# Altium schematic sheet MCU099_02_XDS110_Debug_Probe.SchDoc: XDS110-ET Debug Probe
size 431 x 279 mm; Date: Not shown in title block; ApprovedBy: Not shown in title block; CheckedBy: Not shown in title block; Author: Not shown in title block; CompanyName: Not shown in title block; DrawnBy: Johnson He; Engineer: Not shown in title block; Organization: Not shown in title block; Address1: Not shown in title block; Address2: Not shown in title block; Address3: Not shown in title block; Address4: Not shown in title block; DocumentNumber: 1; Revision: Use project parameter SCH_Rev; SheetNumber: 2; SheetTotal: 6; PageSetup: Record=PageOptions|CenterHorizontal=True|CenterVertical=True|PrintScale=1.00|XCorrection=1.00|YCorrection=1.00|PrintKind=0|BorderSize=5000000|LeftOffset=0|BottomOffset=0|Orientation=2|PaperLength=1000|PaperWidth=1000|Scale=100|PaperSource=15|PrintQuality=600|MediaType=1|DitherType=10|PaperKind=Letter|PrintScaleMode=1; CurrentTime: Not shown in title block; CurrentDate: Not shown in title block; Time: Not shown in title block; DocumentFullPathAndName: Not shown in title block; DocumentName: Not shown in title block; ModifiedDate: Not shown in title block; ImagePath: Not shown in title block
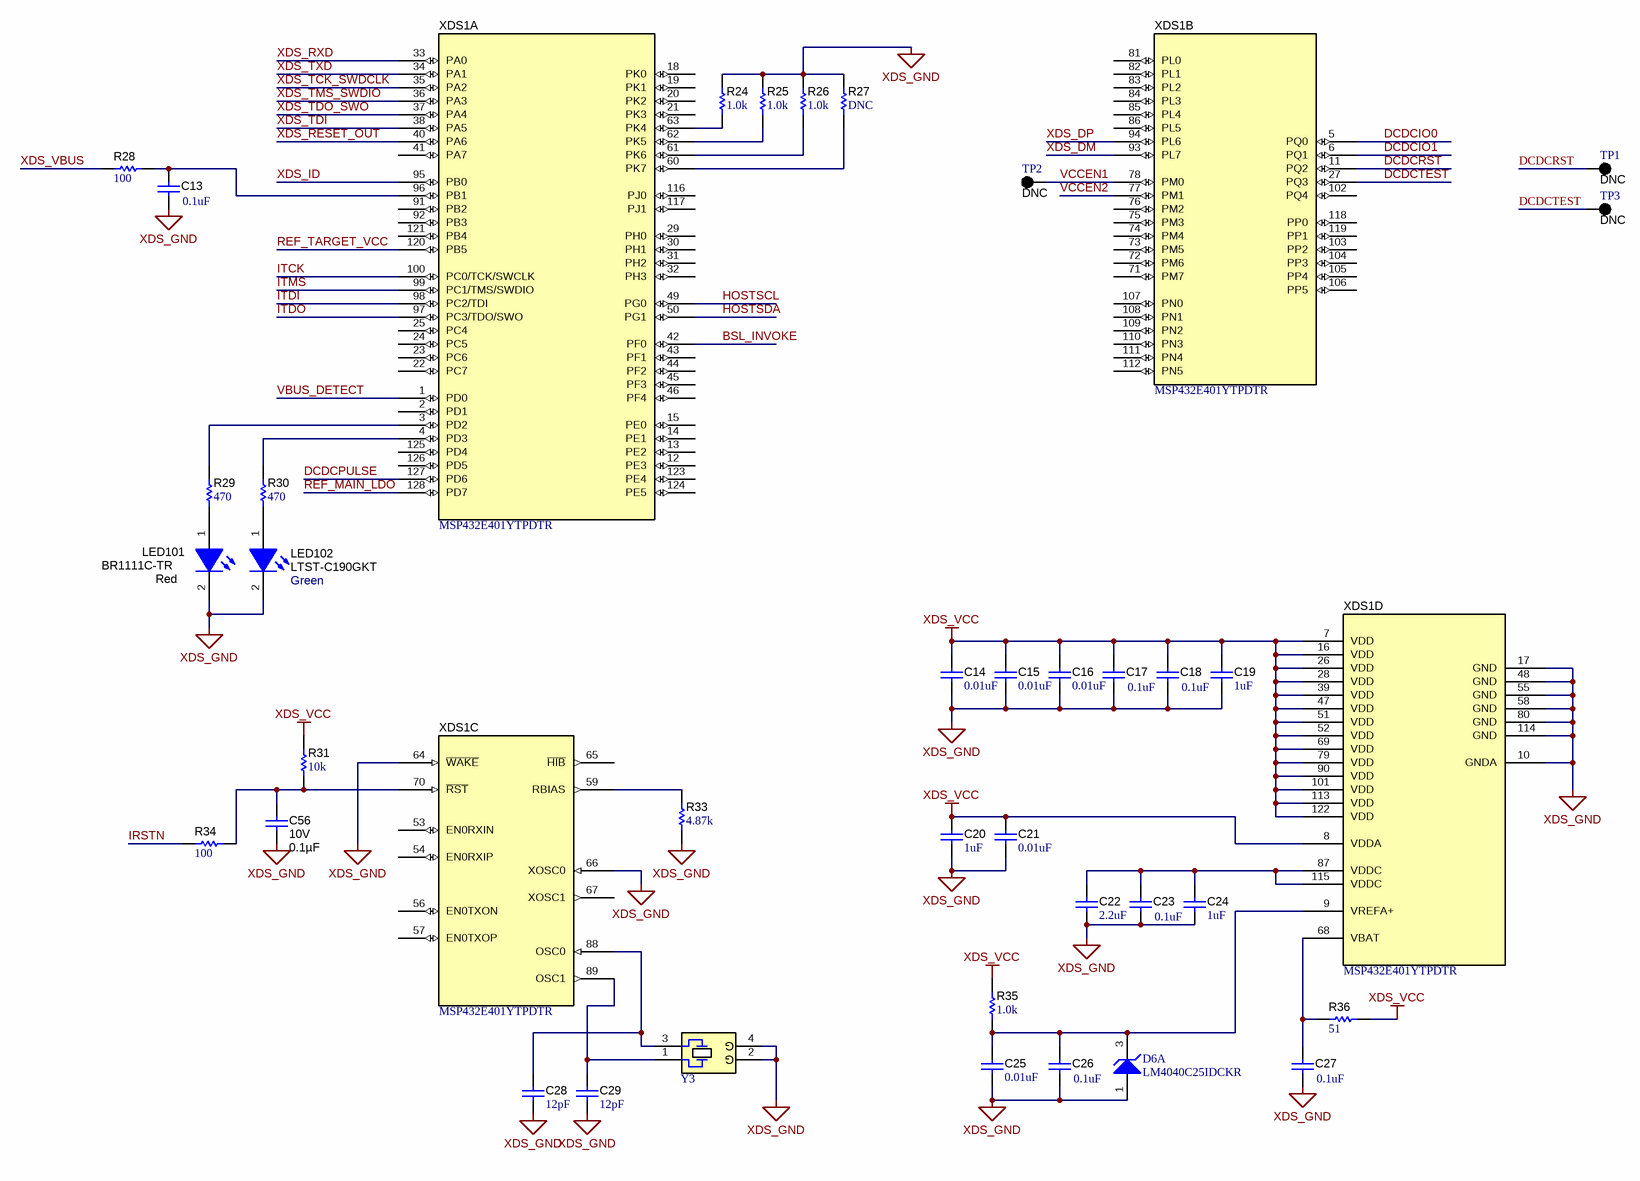
[diagram p0: MCU099_02_XDS110_Debug_Probe.SchDoc]

## Parts
C13  ValueDisplayed: 0.1uF  [0402]  (hidden comment: C1005X5R1A104K050BA)
C14  ValueDisplayed: 0.01uF  [0402]  (hidden comment: GRM155R71E103KA01D)
C15  ValueDisplayed: 0.01uF  [0402]  (hidden comment: GRM155R71E103KA01D)
C16  ValueDisplayed: 0.01uF  [0402]  (hidden comment: GRM155R71E103KA01D)
C17  ValueDisplayed: 0.1uF  [0402]  (hidden comment: C1005X5R1A104K050BA)
C18  ValueDisplayed: 0.1uF  [0402]  (hidden comment: C1005X5R1A104K050BA)
C19  ValueDisplayed: 1uF  [0402]  (hidden comment: C1005X5R1E105K050BC)
C20  ValueDisplayed: 1uF  [0402]  (hidden comment: C1005X5R1E105K050BC)
C21  ValueDisplayed: 0.01uF  [0402]  (hidden comment: GRM155R71E103KA01D)
C22  ValueDisplayed: 2.2uF  [0402]  (hidden comment: GRM155R60J225KE95D)
C23  ValueDisplayed: 0.1uF  [0402]  (hidden comment: C1005X5R1A104K050BA)
C24  ValueDisplayed: 1uF  [0402]  (hidden comment: C1005X5R1E105K050BC)
C25  ValueDisplayed: 0.01uF  [0402]  (hidden comment: GRM155R71E103KA01D)
C26  ValueDisplayed: 0.1uF  [0402]  (hidden comment: C1005X5R1A104K050BA)
C27  ValueDisplayed: 0.1uF  [0402]  (hidden comment: C1005X5R1A104K050BA)
C28  ValueDisplayed: 12pF  [0402]  (hidden comment: GRM1555C1H120JA01D)
C29  ValueDisplayed: 12pF  [0402]  (hidden comment: GRM1555C1H120JA01D)
C56  VDC_V: 10V  ValueDisplayed: 0.1µF  [0402]  (hidden comment: C0402C104K8RACTU)
D6  PartNumber: LM4040C25IDCKR  [DCK0005A_N]  (hidden comment: LM4040B25IDCKR)  (part A of 2)
LED101  BR1111C-TR  value Red  [1111C_Red]
LED102  LTST-C190GKT  value Green  [LED_LTST-C190]
R24  ValueDisplayed: 1.0k  [0402]  (hidden comment: CRCW04021K00JNED)
R25  ValueDisplayed: 1.0k  [0402]  (hidden comment: CRCW04021K00JNED)
R26  ValueDisplayed: 1.0k  [0402]  (hidden comment: CRCW04021K00JNED)
R27  ValueDisplayed: DNC  [0402]  (hidden comment: CRCW04021K00JNED)  (no BOM)
R28  ValueDisplayed: 100  [0402]  (hidden comment: CRCW0402100RJNED)
R29  ValueDisplayed: 470  [0402]  (hidden comment: CRCW0402470RJNED)
R30  ValueDisplayed: 470  [0402]  (hidden comment: CRCW0402470RJNED)
R31  ValueDisplayed: 10k  [0402]  (hidden comment: CRCW040210K0JNED)
R33  ValueDisplayed: 4.87k  [0402]  (hidden comment: CRCW04024K87FKED)
R34  ValueDisplayed: 100  [0402]  (hidden comment: CRCW0402100RJNED)
R35  ValueDisplayed: 1.0k  [0402]  (hidden comment: CRCW04021K00JNED)
R36  ValueDisplayed: 51  [0402]  (hidden comment: CRCW040251R0JNED)
TP1  DNC  [Keystone5001]  (no BOM)
TP2  DNC  [Keystone5001]  (no BOM)
TP3  DNC  [Keystone5001]  (no BOM)
XDS1  MSP432E401YTPDTR  [PDT0128A]  (parts A,B,C,D of 4)
Y3  NX3225GA-16.000M-STD-CRG-1  [NDK_NX3225GA]  (value not drawn)

## Nets
XDS_GND: C13.2 C14.2 C15.2 C16.2 C17.2 C18.2 C19.2 C20.2 C21.2 C22.2 C23.2 C24.2 C25.2 C26.2 C27.2 C28.2 C29.2 C56.2 D6.1(ANODE) LED101.2(K) LED102.2(K) R24.2 R25.2 R26.2 R27.2 R33.1 XDS1.10(GNDA) XDS1.17(GND) XDS1.48(GND) XDS1.55(GND) XDS1.58(GND) XDS1.64(~{WAKE}) XDS1.66(XOSC0) XDS1.80(GND) XDS1.114(GND) Y3.2(GND) Y3.4(GND)
XDS_VCC: C14.1 C15.1 C16.1 C17.1 C18.1 C19.1 C20.1 C21.1 R31.2 R35.2 R36.2 XDS1.7(VDD) XDS1.8(VDDA) XDS1.16(VDD) XDS1.26(VDD) XDS1.28(VDD) XDS1.39(VDD) XDS1.47(VDD) XDS1.51(VDD) XDS1.52(VDD) XDS1.69(VDD) XDS1.79(VDD) XDS1.90(VDD) XDS1.101(VDD) XDS1.113(VDD) XDS1.122(VDD)
BSL_INVOKE: XDS1.42(PF0)
DCDCIO0: XDS1.5(PQ0)
DCDCIO1: XDS1.6(PQ1)
DCDCPULSE: XDS1.127(PD6)
DCDCRST: TP1.1 XDS1.11(PQ2)
DCDCTEST: TP3.1 XDS1.27(PQ3)
HOSTSCL: XDS1.49(PG0)
HOSTSDA: XDS1.50(PG1)
IRSTN: R34.1
ITCK: XDS1.100(PC0/TCK/SWCLK)
ITDI: XDS1.98(PC2/TDI)
ITDO: XDS1.97(PC3/TDO/SWO)
ITMS: XDS1.99(PC1/TMS/SWDIO)
REF_MAIN_LDO: XDS1.128(PD7)
REF_TARGET_VCC: XDS1.120(PB5)
VBUS_DETECT: XDS1.1(PD0)
VCCEN1: TP2.1 XDS1.78(PM0)
VCCEN2: XDS1.77(PM1)
XDS_DM: XDS1.93(PL7)
XDS_DP: XDS1.94(PL6)
XDS_ID: XDS1.95(PB0)
XDS_RESET_OUT: XDS1.40(PA6)
XDS_RXD: XDS1.33(PA0)
XDS_TCK_SWDCLK: XDS1.35(PA2)
XDS_TDI: XDS1.38(PA5)
XDS_TDO_SWO: XDS1.37(PA4)
XDS_TMS_SWDIO: XDS1.36(PA3)
XDS_TXD: XDS1.34(PA1)
XDS_VBUS: R28.1
NetC13_1: C13.1 R28.2 XDS1.96(PB1)
NetC22_1: C22.1 C23.1 C24.1 XDS1.87(VDDC) XDS1.115(VDDC)
NetC25_1: C25.1 C26.1 D6.3(CATHODE) R35.1 XDS1.9(VREFA+)
NetC27_1: C27.1 R36.1 XDS1.68(VBAT)
NetC28_1: C28.1 XDS1.88(OSC0) Y3.3
NetC29_1: C29.1 XDS1.89(OSC1) Y3.1
NetC56_1: C56.1 R31.1 R34.2 XDS1.70(~{RST})
NetLED101_1: LED101.1(A) R29.1
NetLED102_1: LED102.1(A) R30.1
NetR24_1: R24.1 XDS1.63(PK4)
NetR25_1: R25.1 XDS1.62(PK5)
NetR26_1: R26.1 XDS1.61(PK6)
NetR27_1: R27.1 XDS1.60(PK7)
NetR29_2: R29.2 XDS1.3(PD2)
NetR30_2: R30.2 XDS1.4(PD3)
NetR33_2: R33.2 XDS1.59(RBIAS)

Not connected (* = marked no-connect by the designer): XDS1 2(PD1) 12(PE3) 13(PE2) 14(PE1) 15(PE0) 18(PK0) 19(PK1) 20(PK2) 21(PK3) 22(PC7) 23(PC6) 24(PC5) 25(PC4) 29(PH0) 30(PH1) 31(PH2) 32(PH3) 41(PA7) 43(PF1) 44(PF2) 45(PF3) 46(PF4) 53(EN0RXIN) 54(EN0RXIP) 56(EN0TXON) 57(EN0TXOP) 65(~{HIB}) 67(XOSC1) 71(PM7) 72(PM6) 73(PM5) 74(PM4) 75(PM3) 76(PM2) 81(PL0) 82(PL1) 83(PL2) 84(PL3) 85(PL4) 86(PL5) 91(PB2) 92(PB3) 102(PQ4) 103(PP2) 104(PP3) 105(PP4) 106(PP5) 107(PN0) 108(PN1) 109(PN2) 110(PN3) 111(PN4) 112(PN5) 116(PJ0) 117(PJ1) 118(PP0) 119(PP1) 121(PB4) 123(PE4) 124(PE5) 125(PD4) 126(PD5)

## Notes on the sheet
- Drawn By:
- SVN Rev:
- Number:
- TID #:
- Orderable:
- Rev:
- Sheet Title:
- File:
- Project Title:
- Designed for:
- Assembly Variant:
- Mod. Date:
- Sheet:
- Size:
- of
- B
- http://www.ti.com
- Texas Instruments and/or its licensors do not warrant the accuracy or completeness of this specification or any information contained therein. Texas Instruments and/or its licensors do not warrant that this design will meet the specifications, will be suitable for your application or fit for any particular purpose, or will operate in an implementation. Texas Instruments and/or its licensors do not warrant that the design is production worthy. You should completely validate and test your design implementation to confirm the system functionality for your application.
- Engineer:
- Contact:
- © Texas Instruments
- (in symbol CMP-0004635-1) G

## Library data of the parts
C13 C17 C18 C23 C26 C27 = CMP-0006259-2: CAP, CERM, 0.1 uF, 10 V, +/- 10%, X5R, 0402; Manufacturer: TDK; TaMin_C: -55°C; Polarized: N; SizeAreaWB_mm2: 3; Value1: Unknown; U/M: EA; Value: 0.1uF; TaMax_C: 85°C; SizeZ_mm: 0.6; SizeX_mm: 1; SizeY_mm: 0.5; Value2: 10V; Cap_F: 100nF; AEC Category: Q200; Supplier Part Number 2: 90R7585; Publisher: Texas Instruments; Supplier 2: Newark; TempCo: X5R; Published: 2008-06-19; RoHS: Y; MountType: SMT; Supplier 1: Digi-Key; PackageReference: 0402; Tolerance_%: 10%; Cap_Case: 0402; SizeArea_mm2: 0.5; CompType: Capacitor; LatestRevisionDate: 2017-03-09; PartNumber: C1005X5R1A104K050BA; AEC Qualified: ?; VDC_V: 10V; ComponentLink1Description: Datasheet link; Supplier Part Number 1: 445-1265-1-ND; Technology: Ceramic; ComponentLink1URL: http://product.tdk.com/en/catalog/datasheets/mlcc_commercial_general_en.pdf; Supplier 3: Mouser; Supplier Part Number 3: 810-C1005X5R1A104K
C14-C16 C21 C25 = CMP-0006658-2: CAP, CERM, 0.01 uF, 25 V, +/- 10%, X7R, 0402; Manufacturer: MuRata; TaMin_C: -55°C; Polarized: N; SizeAreaWB_mm2: 3; Value1: Unknown; U/M: EA; Value: 0.01uF; TaMax_C: 125°C; SizeZ_mm: 0.6; SizeX_mm: 1; SizeY_mm: 0.5; Value2: 25V; Cap_F: 10nF; AEC Category: Q200; Supplier Part Number 2: 81-GRM36X103K25; Publisher: Texas Instruments; Supplier 2: Mouser; Supplier Part Number 3: 8819734; TempCo: X7R; Supplier 3: Farnell; Published: 2008-06-19; RoHS: Y; MountType: SMT; Supplier 1: Digi-Key; PackageReference: 0402; Tolerance_%: 10%; Cap_Case: 0402; SizeArea_mm2: 0.5; CompType: Capacitor; LatestRevisionDate: 2017-03-09; PartNumber: GRM155R71E103KA01D; AEC Qualified: ?; VDC_V: 25V; ComponentLink1Description: Datasheet link; Supplier Part Number 1: 490-1312-1-ND; Technology: Ceramic; ComponentLink1URL: http://search.murata.co.jp/Ceramy/PnsearchViewAction.do?HnOFG=ON&HnNFG=ON&SEL_CNT=50&sLang=en&sKey=GRM155R71E103KA01D&x=9&y=9&search=startwith
C19 C20 C24 = CMP-0006276-2: CAP, CERM, 1 uF, 25 V, +/- 10%, X5R, 0402; Manufacturer: TDK; TaMin_C: -55°C; Polarized: N; SizeAreaWB_mm2: 3; Value1: Unknown; U/M: EA; Value: 1uF; TaMax_C: 80°C; SizeZ_mm: 0.6; SizeX_mm: 1; SizeY_mm: 0.5; Value2: 25V; Cap_F: 1µF; AEC Category: Q200; ComponentLink1URL: https://product.tdk.com/info/en/catalog/datasheets/mlcc_commercial_general_en.pdf; Supplier Part Number 2: 07W9127; Publisher: Texas Instruments; Supplier 2: Newark; Supplier Part Number 3: 810-C1005X5R1E105K; TempCo: X5R; Supplier 3: Mouser; Published: 2008-06-19; RoHS: Y; MountType: SMT; Supplier 1: Digi-Key; PackageReference: 0402; Tolerance_%: 10%; Cap_Case: 0402; SizeArea_mm2: 0.5; CompType: Capacitor; PartNumber: C1005X5R1E105K050BC; AEC Qualified: N; VDC_V: 25V; ComponentLink1Description: Datasheet link; Supplier Part Number 1: 445-9066-1-ND; LatestRevisionDate: 2017-03-09; Technology: Ceramic; AEC Grade: N/A
C22 = CMP-0006543-2: CAP, CERM, 2.2 uF, 6.3 V, +/- 10%, X5R, 0402; Manufacturer: MuRata; TaMin_C: -55°C; Polarized: N; SizeAreaWB_mm2: 3; Value1: Unknown; U/M: EA; Value: 2.2uF; TaMax_C: 85°C; SizeZ_mm: 0.6; SizeX_mm: 1; SizeY_mm: 0.5; Value2: 6.3V; Cap_F: 2.2µF; AEC Category: Q200; Publisher: Texas Instruments; TempCo: X5R; Published: 2008-06-19; RoHS: Y; MountType: SMT; Supplier 1: Mouser; PackageReference: 0402; Tolerance_%: 10%; Cap_Case: 0402; SizeArea_mm2: 0.5; CompType: Capacitor; LatestRevisionDate: 2017-03-09; PartNumber: GRM155R60J225KE95D; AEC Qualified: N; VDC_V: 6.3V; ComponentLink1Description: Datasheet link; AEC Grade: N/A; Supplier Part Number 1: 81-GRM155R60J225KE5D; Technology: Ceramic; ComponentLink1URL: http://psearch.en.murata.com/capacitor/product/GRM155R60J225KE95%23.pdf
C28 C29 = CMP-0006415-2: CAP, CERM, 12 pF, 50 V, +/- 5%, C0G/NP0, 0402; Manufacturer: MuRata; TaMin_C: -55°C; Polarized: N; SizeAreaWB_mm2: 3; Value1: Unknown; U/M: EA; Value: 12pF; TaMax_C: 125°C; SizeZ_mm: 0.6; SizeX_mm: 1; SizeY_mm: 0.5; Value2: 50V; AEC Category: Q200; Supplier Part Number 2: 81-GRM1555C1H120JA1D; Publisher: Texas Instruments; Supplier 2: Mouser; Supplier Part Number 3: 1828875; TempCo: C0G/NP0; Supplier 3: Farnell; Published: 2008-06-19; RoHS: Y; MountType: SMT; Supplier 1: Newark; PackageReference: 0402; Tolerance_%: 5%; Cap_Case: 0402; SizeArea_mm2: 0.5; CompType: Capacitor; LatestRevisionDate: 2017-03-09; PartNumber: GRM1555C1H120JA01D; AEC Qualified: ?; Cap_F: 12pF; VDC_V: 50V; ComponentLink1Description: Datasheet link; Supplier Part Number 1: 14T3292; Technology: Ceramic; ComponentLink1URL: http://search.murata.co.jp/Ceramy/PnsearchViewAction.do?HnOFG=ON&HnNFG=ON&SEL_CNT=50&sLang=en&sKey=GRM1555C1H120JA01D&x=9&y=9&search=startwith
C56 = CMP-0078241-1: CAP, CERM, 0.1 µF, 10 V,+/- 10%, X7R, 0402; Manufacturer: Kemet; TaMin_C: -55°C; Polarized: N; SizeAreaWB_mm2: 3; U/M: EA; Value: 0.1uF; TaMax_C: 125°C; SizeZ_mm: 0.6; SizeX_mm: 1; SizeY_mm: 0.5; Cap_F: 100nF; AEC Category: Q200; ComponentLink1URL: https://content.kemet.com/datasheets/KEM_C1002_X7R_SMD.pdf; Supplier Part Number 2: 68X2393; Supplier 2: Newark; Supplier Part Number 3: 80-C0402C104K8R; TempCo: X7R; Supplier 3: Mouser; RoHS: Y; MountType: SMT; Supplier 1: Digi-Key; PackageReference: 0402; Tolerance_%: 10%; Cap_Case: 0402; Value2: 10V; SizeArea_mm2: 0.5; CompType: Capacitor; PartNumber: C0402C104K8RACTU; AEC Qualified: N; ComponentLink1Description: Datasheet link; AEC Grade: N/A; Supplier Part Number 1: 399-3520-1-ND; Technology: Ceramic
D6 = CMP-0032785-2: Precision Micropower Shunt Voltage Reference, 0.2% accuracy, 2.5 V, 15 ppm / degC, 15 mA, -40 to 85 degC, 5-pin SC70 (DCK), Green (RoHS & no Sb/Br); Manufacturer: Texas Instruments; Iout/Iz(Max)(mA): 15; Temp Coeff(Max)(ppm/ degree C): 100; VO(V): 2.5; Min Iz for Regulation(uA): 75; Initial Accuracy @ 25/deg C(%): 0.2; Rating: Catalog; AEC Category: Q200; AEC Qualified: N; CompType: IC; SizeAreaWB_mm2: 9.3; SizeArea_mm2: 4.2; SizeX_mm: 2.1; SizeY_mm: 2.0; SizeZ_mm: 1.1; ComponentLink1URL: http://www.ti.com/lit/ds/symlink/lm4040.pdf; PackageReference: DCK0005A; ComponentLink1Description: Datasheet Link; ComponentLink2URL: http://www.ti.com/product/lm4040; ComponentLink2Description: Product Folder; Code_JEDEC: MO-203; DatasheetVersion: SLOS456K; ComponentLink3URL: http://www.ti.com/product/lm4040/datasheet; Eco-Plan: Green (RoHS & no Sb/Br); ComponentLink3Description: Online Datasheet; PackageDescription: SOT-SC70-5; SubFamily: Shunt Voltage Reference; Temp Coeff(Typ)(ppm/ degree C): 15; MountType: SMT; RoHS: Y; PartId: 1
LED101 = CMP-0002972-3: LED, Red, SMD; Manufacturer: Stanley Electric Co., LTD; Power_TotalModule: 57.5mW; Vr_V: 4V; Value1: 0.0575W; Ir_A: 100µA; Io_A: 20mA; Value2: 1.7V; Tjmax_C: 85°C; RoHS: Y; Type: ?; ComponentLink1URL: https://sps06.itg.ti.com/sites/KMS/crossdivteams/altium/docs/ComponentDatasheets/BR1111C-TR.pdf; PackageReference: 1.6x0.8mm; PartNumber: BR1111C-TR; MountType: SMT; ComponentLink1Description: Datasheet link; CompType: LED; Color: Red; Vf_V: 1.7V
LED102 = CMP-0002827-3: LED, Green, SMD; Manufacturer: Lite-On; Power_TotalModule: 100mW; Value2: 2.1V; Io_A: 20mA; Value1: 0.1W; ComponentLink1Description: Datasheet link; PackageReference: 1.6x0.8x0.8mm; CompType: LED; Type: ?; ComponentLink1URL: https://sps06.itg.ti.com/sites/KMS/crossdivteams/altium/docs/ComponentDatasheets/LTST-C190GKT.pdf; Color: green; Vf_V: 2.1V; PartNumber: LTST-C190GKT; RoHS: Y; MountType: SMT
R24-R27 R35 = CMP-0026852-1: RES, 1.0 k, 5%, 0.063 W, 0402; Manufacturer: Vishay-Dale; Power_W: 63mW; TempCo: 200 ppm/C; Value_Code: 1k00; U/M: EA; Value: 1.0k; EIA_Code: E24; Res_ohm: 1k; SizeX_mm: 1; SizeY_mm: 0.5; SizeZ_mm: 0.6; Value2: 0.063W; VDC_V: 50V; AEC Category: Q200; ComponentLink1URL: http://www.vishay.com/docs/20035/dcrcwe3.pdf; Supplier Part Number 2: 59M6691; Publisher: Texas Instruments; Supplier 2: Newark; Supplier Part Number 3: 71-CRCW0402J-1.0K-E3; Supplier 3: Mouser; Published: 2008-06-26; RoHS: Y; Value1: 5%; MountType: SMT; Supplier 1: Digi-Key; PackageReference: 0402; Tolerance_%: 5%; SizeArea_mm2: 0.5; CompType: Resistor; LatestRevisionDate: 2017-03-09; PartNumber: CRCW04021K00JNED; AEC Qualified: ?; ComponentLink1Description: Datasheet link; Supplier Part Number 1: 541-1.0KJCT-ND; Technology: Thick Film
R28 = CMP-0026824-3: RES, 100, 5%, 0.063 W, AEC-Q200 Grade 0, 0402; Manufacturer: Vishay-Dale; Power_W: 63mW; TempCo: 200 ppm/C; Value_Code: 100R; Value: 100; EIA_Code: E24; SizeX_mm: 1; SizeY_mm: 0.5; SizeZ_mm: 0.6; Value2: 0.063W; AEC Qualified: Y; VDC_V: 50V; AEC Category: Q200; AEC Grade: 0; Supplier Part Number 2: 59M6700; Supplier 2: Newark; Supplier Part Number 3: 71-CRCW0402J-100-E3; Supplier 3: Mouser; RoHS: E; Value1: 5%; MountType: SMT; Supplier 1: Digi-Key; PackageReference: 0402; Tolerance_%: 5%; Res_ohm: 100; SizeArea_mm2: 0.5; CompType: Resistor; PartNumber: CRCW0402100RJNED; ComponentLink1Description: Datasheet link; Supplier Part Number 1: 541-100JCT-ND; Technology: Thick Film; ComponentLink1URL: http://www.vishay.com/docs/20035/dcrcwe3.pdf
R29 R30 = CMP-0026934-2: RES, 470, 5%, 0.063 W, 0402; Manufacturer: Vishay-Dale; Power_W: 63mW; TempCo: 200 ppm/C; Value_Code: 470R; U/M: EA; Value: 470; EIA_Code: E24; SizeX_mm: 1; SizeY_mm: 0.5; SizeZ_mm: 0.6; Value2: 0.063W; VDC_V: 50V; AEC Category: Q200; Supplier Part Number 2: 59M6737; Publisher: Texas Instruments; Supplier 2: Newark; Supplier Part Number 3: 71-CRCW0402J-470-E3; Supplier 3: Mouser; Published: 2008-06-26; RoHS: Y; Value1: 5%; MountType: SMT; Supplier 1: Digi-Key; PackageReference: 0402; Tolerance_%: 5%; Res_ohm: 470; SizeArea_mm2: 0.5; CompType: Resistor; LatestRevisionDate: 2017-03-09; PartNumber: CRCW0402470RJNED; AEC Qualified: ?; ComponentLink1Description: Datasheet link; Supplier Part Number 1: 541-470JCT-ND; Technology: Thick Film; ComponentLink1URL: http://www.vishay.com/docs/20035/dcrcwe3.pdf
R31 = CMP-0026825-4: RES, 10 k, 5%, 0.063 W, 0402; Manufacturer: Vishay-Dale; Power_W: 63mW; TempCo: 200 ppm/C; Value_Code: 10k0; U/M: EA; Value: 10k; EIA_Code: E24; SizeX_mm: 1; SizeY_mm: 0.5; SizeZ_mm: 0.6; Value2: 0.063W; VDC_V: 50V; AEC Category: Q200; Supplier Part Number 2: 59M6696; Publisher: Texas Instruments; Supplier 2: Newark; Supplier Part Number 3: 71-CRCW0402J-10K-E3; Supplier 3: Mouser; Published: 2008-06-26; RoHS: Y; Value1: 5%; MountType: SMT; Supplier 1: Digi-Key; PackageReference: 0402; Tolerance_%: 5%; Res_ohm: 10k; SizeArea_mm2: 0.5; CompType: Resistor; LatestRevisionDate: 2017-03-09; PartNumber: CRCW040210K0JNED; AEC Qualified: ?; ComponentLink1Description: Datasheet link; Supplier Part Number 1: 541-10KJCT-ND; Technology: Thick Film; ComponentLink1URL: http://www.vishay.com/docs/20035/dcrcwe3.pdf
R33 = CMP-0026413-2: RES, 4.87 k, 1%, 0.063 W, AEC-Q200 Grade 0, 0402; Manufacturer: Vishay-Dale; Power_W: 63mW; TempCo: 100 ppm/C; Value_Code: 4k87; Value: 4.87k; EIA_Code: E96; SizeX_mm: 1; SizeY_mm: 0.5; SizeZ_mm: 0.6; Value2: 0.063W; AEC Qualified: Y; VDC_V: 50V; AEC Category: Q200; AEC Grade: 0; ComponentLink1URL: http://www.vishay.com/docs/20035/dcrcwe3.pdf; Supplier Part Number 2: 52K7047; Supplier 2: Newark; Supplier Part Number 3: 71-CRCW0402-4.87K-E3; Supplier 3: Mouser; RoHS: E; Value1: 1%; MountType: SMT; Supplier 1: Digi-Key; PackageReference: 0402; Tolerance_%: 1%; Res_ohm: 4.87k; SizeArea_mm2: 0.5; CompType: Resistor; PartNumber: CRCW04024K87FKED; ComponentLink1Description: Datasheet link; Supplier Part Number 1: 541-4.87KLCT-ND; Technology: Thick Film
R34 = CMP-0026824-1: RES, 100, 5%, 0.063 W, 0402; Manufacturer: Vishay-Dale; Power_W: 63mW; TempCo: 200 ppm/C; Value_Code: 100R; U/M: EA; Value: 100; EIA_Code: E24; SizeX_mm: 1; SizeY_mm: 0.5; SizeZ_mm: 0.6; Value2: 0.063W; VDC_V: 50V; AEC Category: Q200; ComponentLink1URL: http://www.vishay.com/docs/20035/dcrcwe3.pdf; Supplier Part Number 2: 59M6700; Publisher: Texas Instruments; Supplier 2: Newark; Supplier Part Number 3: 71-CRCW0402J-100-E3; Supplier 3: Mouser; Published: 2008-06-26; RoHS: Y; Value1: 5%; MountType: SMT; Supplier 1: Digi-Key; PackageReference: 0402; Tolerance_%: 5%; Res_ohm: 100; SizeArea_mm2: 0.5; CompType: Resistor; LatestRevisionDate: 2017-03-09; PartNumber: CRCW0402100RJNED; AEC Qualified: ?; ComponentLink1Description: Datasheet link; Supplier Part Number 1: 541-100JCT-ND; Technology: Thick Film
R36 = CMP-0026946-3: RES, 51, 5%, 0.063 W, AEC-Q200 Grade 0, 0402; Manufacturer: Vishay-Dale; Power_W: 63mW; TempCo: 200 ppm/C; Value_Code: 51R0; Value: 51; EIA_Code: E24; SizeX_mm: 1; SizeY_mm: 0.5; SizeZ_mm: 0.6; Value2: 0.063W; AEC Qualified: Y; VDC_V: 50V; AEC Category: Q200; AEC Grade: 0; Supplier Part Number 2: 72M6804; Supplier 2: Newark; Supplier Part Number 3: 71-CRCW0402J-51-E3; Supplier 3: Mouser; RoHS: E; Value1: 5%; MountType: SMT; Supplier 1: Digi-Key; PackageReference: 0402; Tolerance_%: 5%; Res_ohm: 51; SizeArea_mm2: 0.5; CompType: Resistor; PartNumber: CRCW040251R0JNED; ComponentLink1Description: Datasheet link; Supplier Part Number 1: 541-51JCT-ND; Technology: Thick Film; ComponentLink1URL: http://www.vishay.com/docs/20035/dcrcwe3.pdf
TP1-TP3 = CMP-0055138-1: Test Point, Miniature, Black, TH; Manufacturer: Keystone; CNHeader: FALSE; Green_Lifecycle: Active; Green_REACh: Passed; ContactFinish: Silver; CT: TRUE; ComponentLink1URL: http://www.keyelco.com/userAssets/file/M60-2p60.pdf; Supplier Part Number 2: 534-5001; Publisher: Texas Instruments; Supplier 2: Mouser; Color: Black; RoHS: Y; MountType: TH; Green_EU RoHS-2: Incomplete; Supplier 1: Digi-Key; Green_EU RoHS: Passed; PackageReference: Black Miniature Testpoint; CompType: Test Point; LatestRevisionDate: 26/05/2017; PartNumber: 5001; ComponentLink1Description: Datasheet URL; Supplier Part Number 1: 36-5001-ND
XDS1 = CMP-0077954-1: MSP432E401YTPDT, PDT0128A (TQFP-128); Alternate Manufacturer: Texas Instruments; SizeAreaWB_mm2: 324; SizeZ_mm: 1.2; SizeX_mm: 16; SizeArea_mm2: 256; CompType: IC; AEC Qualified: N; AEC Category: Q200; ComponentLink1URL: http://www.ti.com/lit/ds/symlink/tm4c129encpdt.pdf; Alternate PartNumber: MSP432E401YTPDT; PackageDescription: TQFP-128; MountType: SMT; ComponentLink2URL: TBD; ComponentLink2Description: Product Folder; Manufacturer: Texas Instruments; PackageReference: PDT0128A; SizeY_mm: 16; PartNumber: MSP432E401YTPDTR; ComponentLink1Description: Datasheet Link; PartId: 1
Y3 = CMP-0004635-1: Crystal, 16 MHz, 8pF, SMD; Manufacturer: NDK; TaMax_C: 70°C; TaMin_C: -10°C; Frequency Stability: +/-30ppm; U/M: EA; Frequency_Fixed: 16MHz; ComponentLink1URL: http://www.ndk.com/images/products/catalog/c_NX3225GA-STD-CRG-1_e.pdf; Publisher: Texas Instruments; Supplier 1: Digi-Key; PackageReference: 3.2x0.75x2.5mm; CompType: Crystal; LatestRevisionDate: 18/04/2017; RoHS: Y; Supplier Part Number 1: 644-1157-1-ND; MountType: SMT; PartNumber: NX3225GA-16.000M-STD-CRG-1; ComponentLink1Description: Datasheet Link